# Altium project jlink-Isolator-si8605.PrjPcb
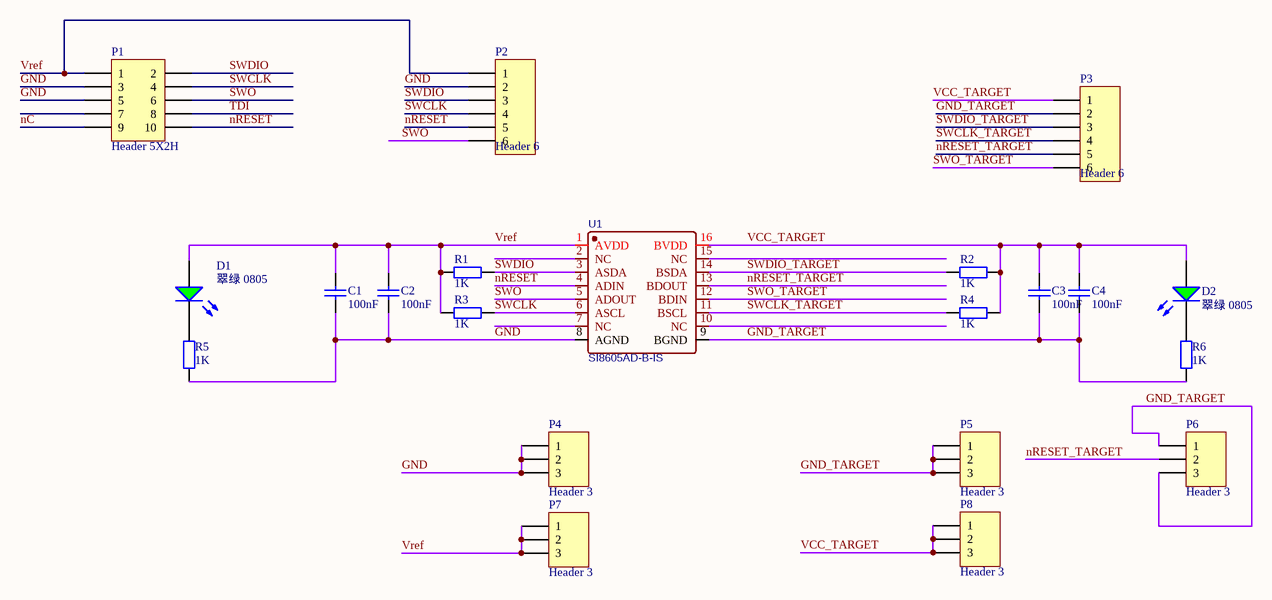
[diagram p0: SCH1.SchDoc]
1 sheet, 21 parts. Net scope: global (net labels, ports and power ports of the same name join across sheets).
Board file: jlinker-isolator.PcbDoc

## Sheet SCH1.SchDoc
size A4

### Parts
C1  100nF  [0603_C]
C2  100nF  [0603_C]
C3  100nF  [0603_C]
C4  100nF  [0603_C]
D1  翠绿 0805  [0805_LED_S1]
D2  翠绿 0805  [0805_LED_S1]
P1  Header 5X2H  [MHDR2X5]
P2  Header 6  [HDR1X6]
P3  Header 6  [HDR1X6]
P4  Header 3  [HDR1X3]
P5  Header 3  [HDR1X3]
P6  Header 3  [HDR1X3]
P7  Header 3  [HDR1X3]
P8  Header 3  [HDR1X3]
R1  1K  [0603_R]
R2  1K  [0603_R]
R3  1K  [0603_R]
R4  1K  [0603_R]
R5  1K  [0603_R]
R6  1K  [0603_R]
U1  SI8605AD-B-IS  [si8605]

### Nets
GND: C1.1 C2.1 P1.3 P1.5 P2.2 P4.1 P4.2 P4.3 R5.2 U1.8(AGND)
GND_TARGET: C3.1 C4.1 P3.2 P5.1 P5.2 P5.3 P6.1 P6.3 R6.2 U1.9(BGND)
nC: P1.9
nRESET: P1.10 P2.5 U1.4(ADIN)
nRESET_TARGET: P3.5 P6.2 U1.13(BDOUT)
SWCLK: P1.4 P2.4 R3.1 U1.6(ASCL)
SWCLK_TARGET: P3.4 R4.1 U1.11(BSCL)
SWDIO: P1.2 P2.3 R1.1 U1.3(ASDA)
SWDIO_TARGET: P3.3 R2.1 U1.14(BSDA)
SWO: P1.6 P2.6 U1.5(ADOUT)
SWO_TARGET: P3.6 U1.12(BDIN)
TDI: P1.8
VCC_TARGET: C3.2 C4.2 D2.A P3.1 P8.1 P8.2 P8.3 R2.2 R4.2 U1.16(BVDD)
Vref: C1.2 C2.2 D1.A P1.1 P2.1 P7.1 P7.2 P7.3 R1.2 R3.2 U1.1(AVDD)
NetD1_K: D1.K R5.1
NetD2_K: D2.K R6.1

Not connected (* = marked no-connect by the designer): P1 7; U1 2(NC) 7(NC) 10(NC) 15(NC)

### Notes on the sheet
- Title
- Size:
- Date:
- File:
- E
- Number:
- Time:
- Revision:
- Sheet
- of

### Library data of the parts
C1-C4 = 0603 100nF (104) 10% 50V: 0603贴片电容; ComponentLink1Description: 供应商链接; ComponentLink1URL: http://www.szlcsc.com/product/details_15331.html; Package: 0603; Supplier: LC; SuppliersPartNumber: C14663
D1 D2 = 0805 翠绿: 发光二极管; ComponentLink1Description: 供应商链接; ComponentLink1URL: http://www.szlcsc.com/product/details_2670.html; Package: 0805; Supplier: LC; SuppliersPartNumber: C2297
P1 = Header 5X2H: Header, 5-Pin, Dual row, Right Angle; LatestRevisionDate: 17-Jul-2002; LatestRevisionNote: Re-released for DXP Platform.; Publisher: Altium Limited
P2 P3 = Header 6: Header, 6-Pin; LatestRevisionDate: 17-Jul-2002; LatestRevisionNote: Re-released for DXP Platform.; Publisher: Altium Limited
P4-P8 = Header 3: Header, 3-Pin; LatestRevisionDate: 17-Jul-2002; LatestRevisionNote: Re-released for DXP Platform.; Publisher: Altium Limited
R1-R6 = Res2: 0603贴片电阻; Published: 8-Jun-2000; LatestRevisionDate: 17-Jul-2002; LatestRevisionNote: Re-released for DXP Platform.; PackageReference: AXIAL-0.4; Publisher: Altium Limited; PackageDescription: Axial Device, Thru-Hole; 2 Leads; 0.4 in Pin Spacing
U1 = SI8605AD-B-IS: BOM_Manufacturer: SILICON LABS; Contributor: LCSC; BOM_Supplier: LCSC; BOM_Supplier Part: C430262; BOM_Manufacturer Part: SI8605AD-B-IS; BOM_JLCPCB Part Class: Extended Part; spicePre: U; spiceSymbolName: SI8605AD-B-IS